# EAGLE board CM4 (EAGLE 9.6.2)
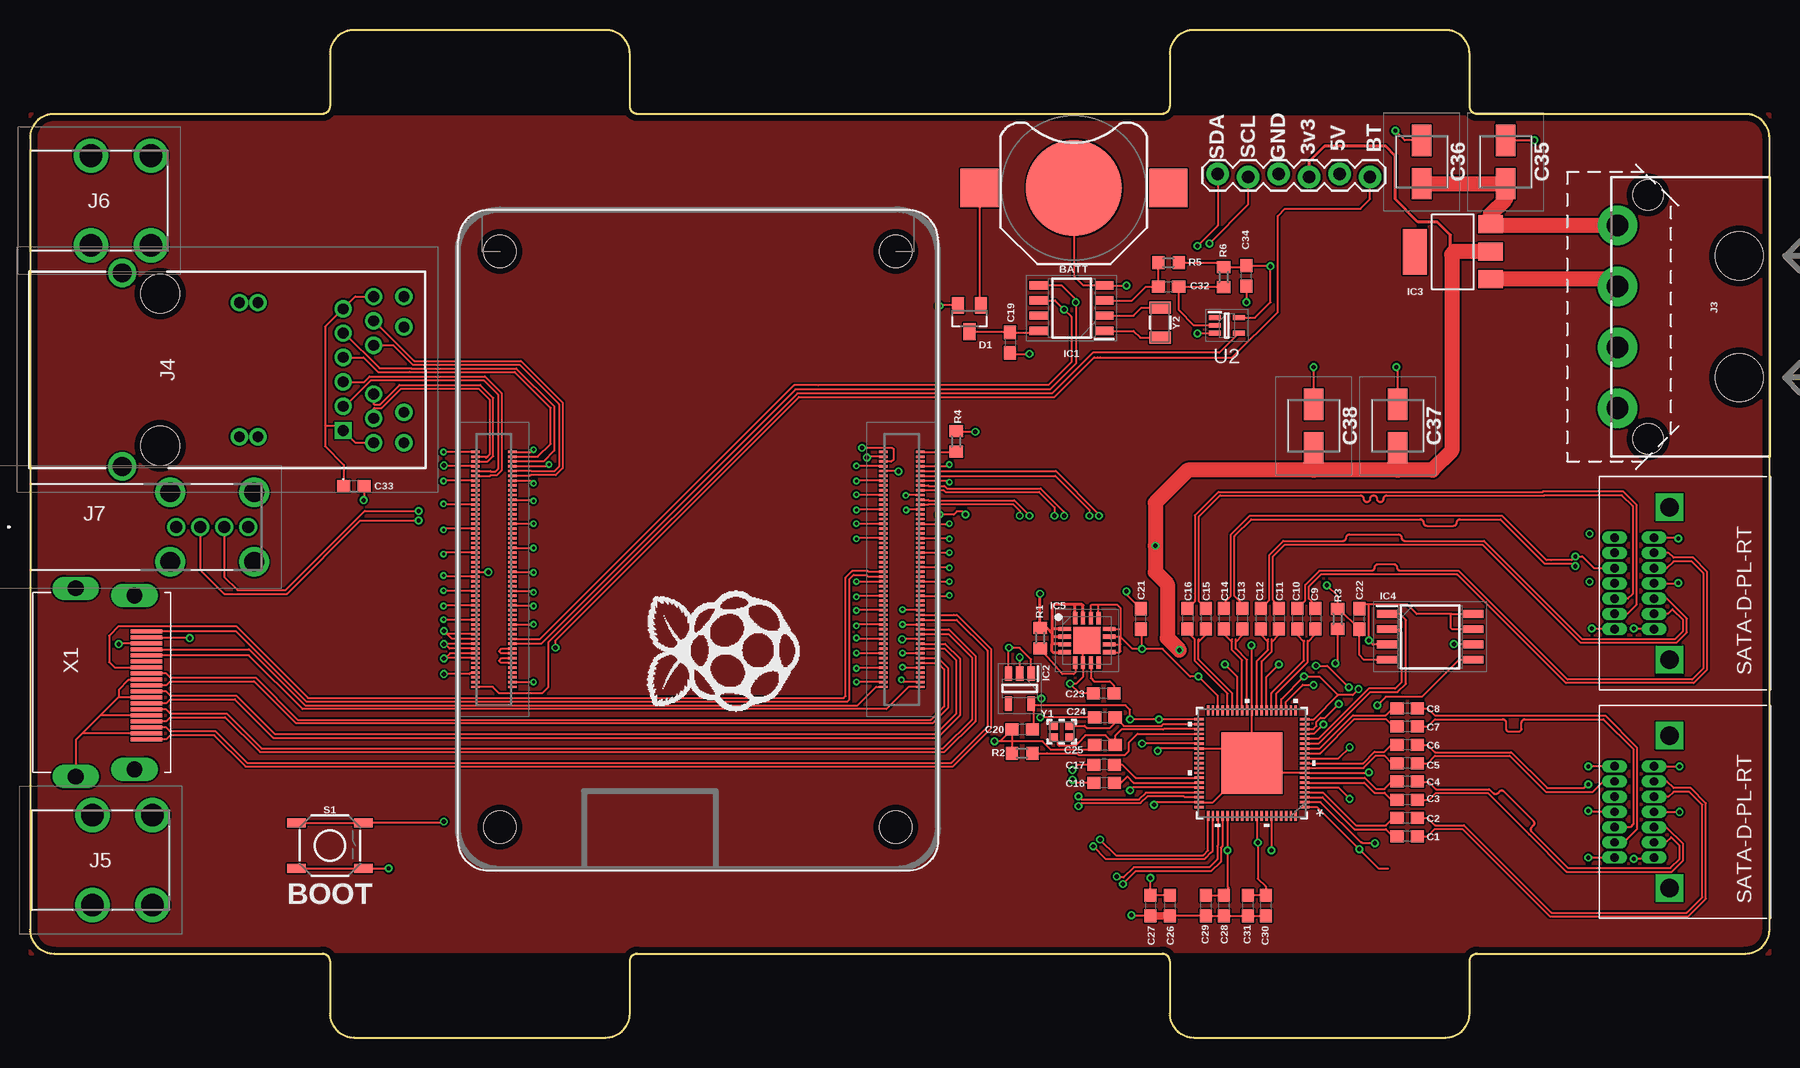
[diagram p2: board, top side]
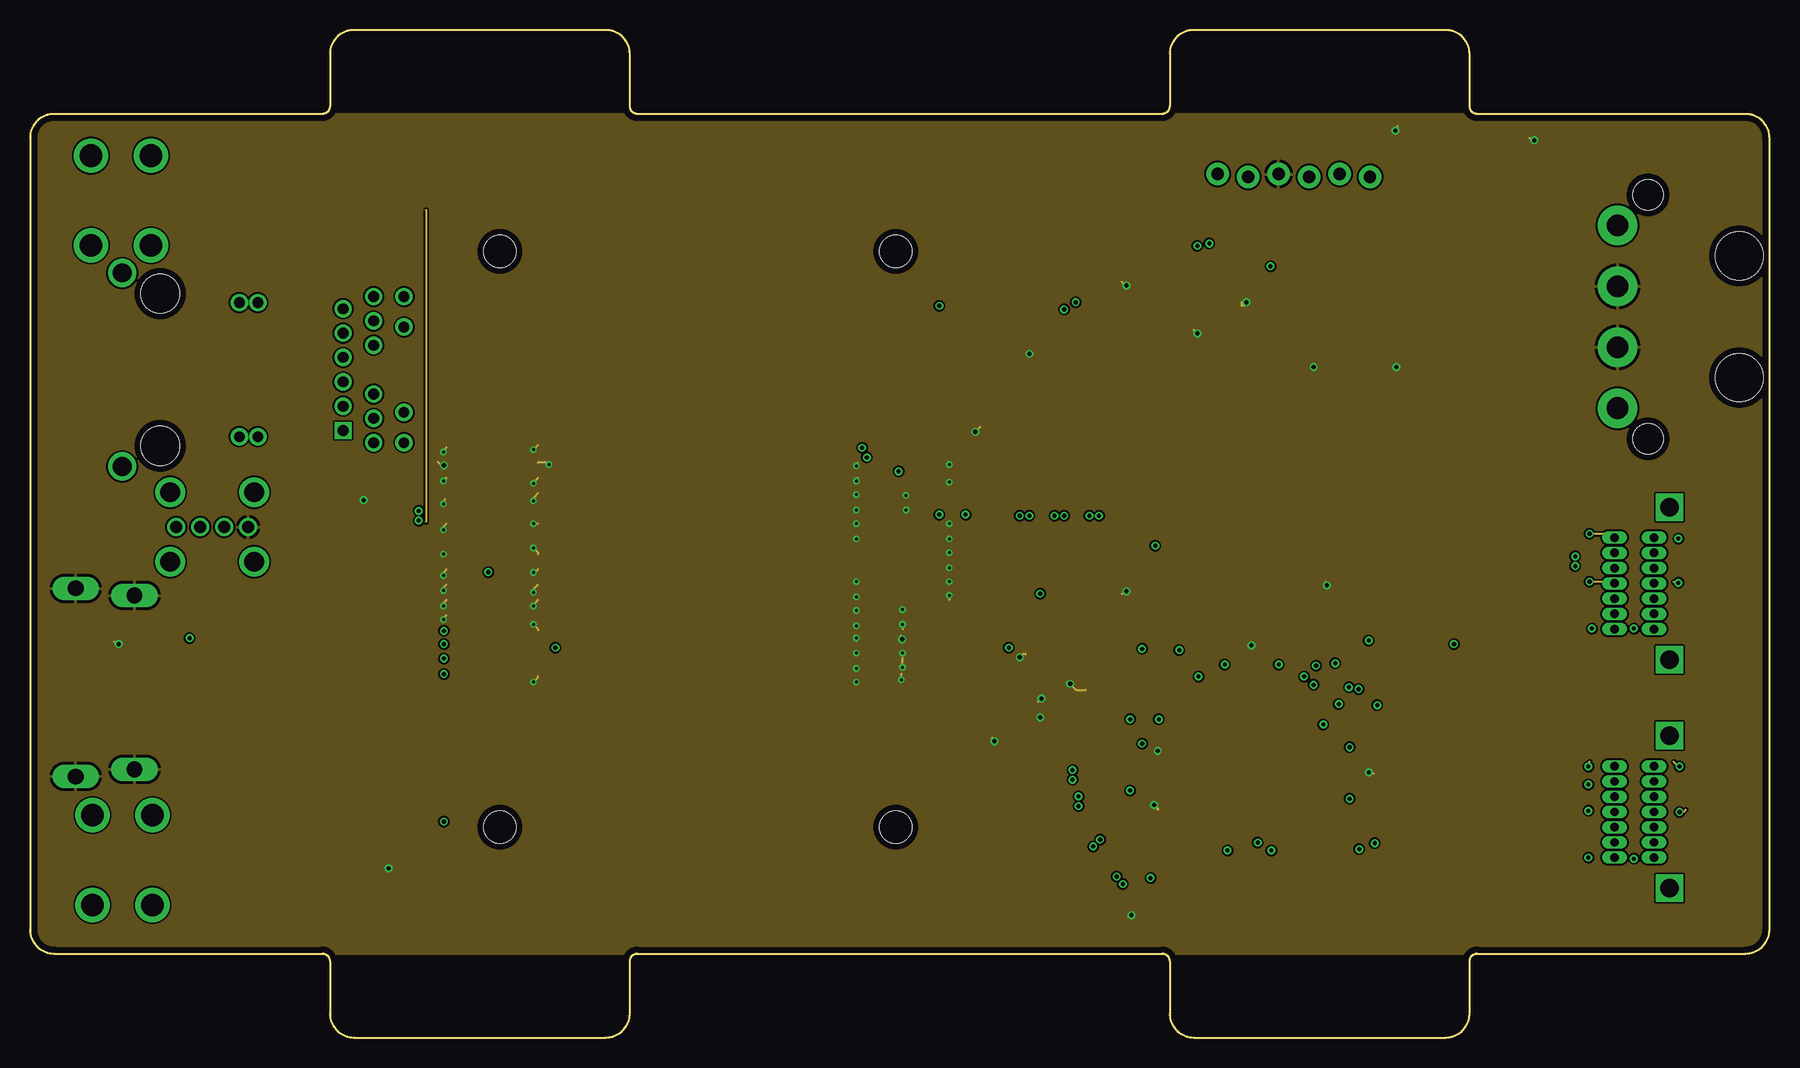
[diagram p3: board, inner layer Route2]
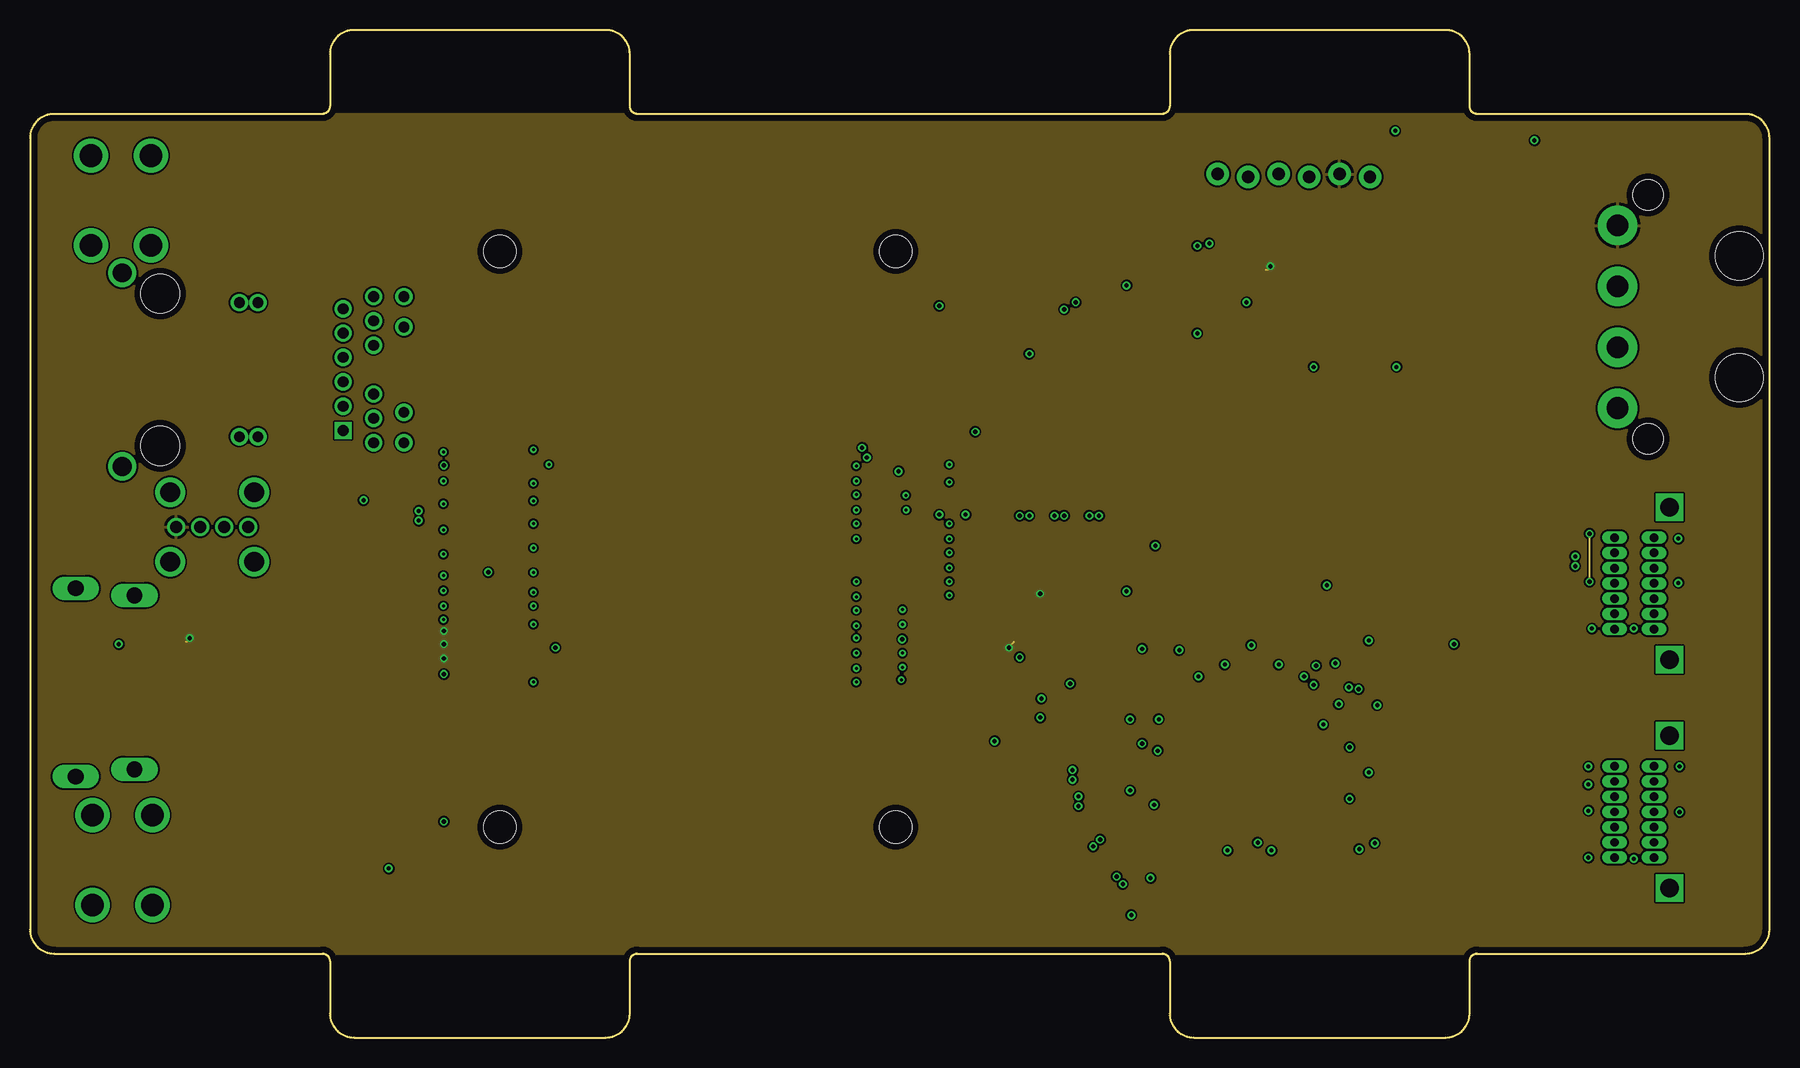
[diagram p4: board, inner layer Route15]
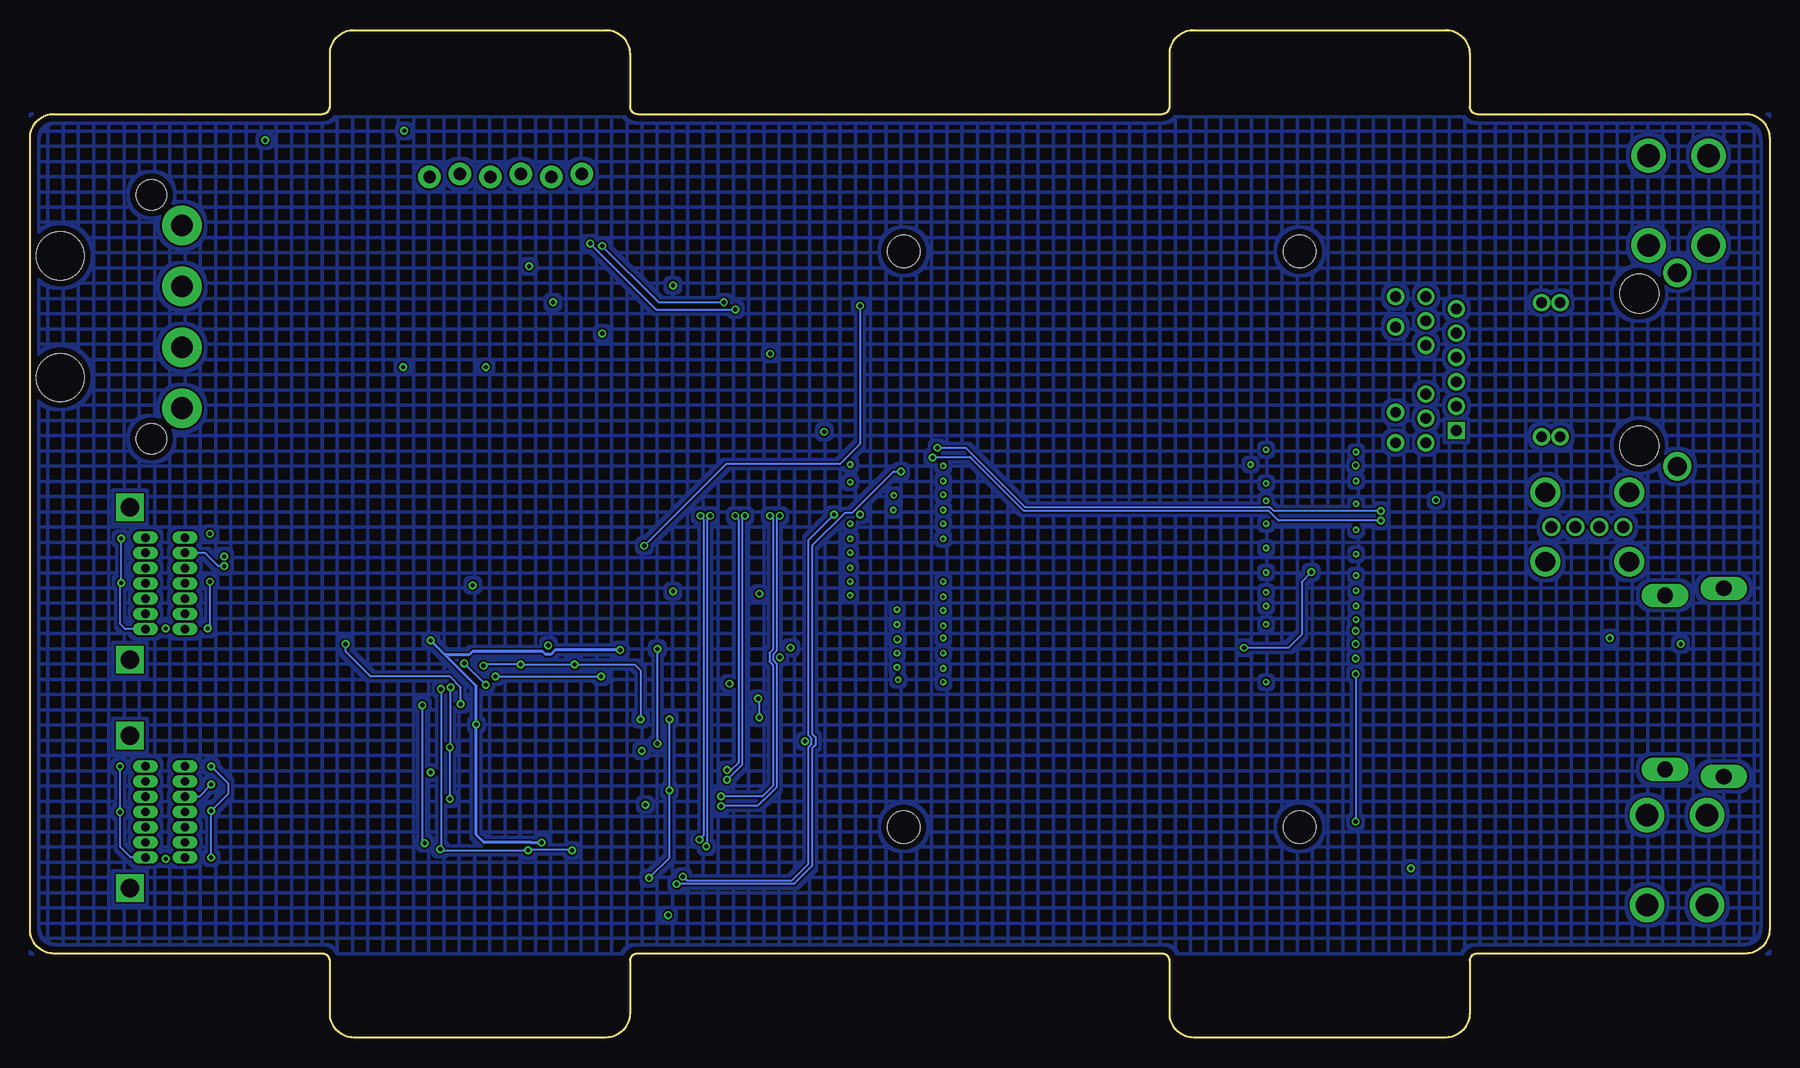
[diagram p5: board, bottom side, seen from below]

Size 145 x 84 mm. Coordinates in mm from the lower left corner, seen from the top.
Outline: 0,73.89 0,9.57
Outline: 2,7 24.36,7 arc-90 25,6.37 25,2 arc90 27,0 48,0 arc90 50,2 50,6.37 arc-90 50.63,7 94.36,7 arc-90 95,6.37 95,2 arc90 97,0 118,0 arc90 120,2 120,6.37 arc-90 120.64,7 143,7 arc90 145,9 145,75 arc90 143,77 120.64,77 arc-90 120,77.64 120,82 arc90 118,84 97,84 arc90 95,82 95,77.64 arc-90 94.36,77 50.63,77 arc-90 50,77.64 50,82 arc90 48,84 27,84 arc90 25,82 25,77.64 arc-90 24.36,77 2,77 arc90 0,75 0,9 arc90 2,7
Copper layers (1+2*15+16): Top 0.035mm / dielectric 1.5mm / Route2 0.035mm / dielectric 0.15mm / Route15 0.035mm / dielectric 0.2mm / Bottom 0.035mm
Design rules "default *": minimum track width 6mil, minimum drill 0.35mm, track to track 6mil, track to pad 6mil, pad to pad 6mil, via to via 6mil, smd to smd 6mil, copper to edge 20mil, drill to drill 6mil, minimum pad ring 6mil, minimum via ring 6mil, stop-mask expansion 4mil, vias tented up to drill 20mil, thermal gap 10mil
tKeepout: area 91.9,12.9 to 111.8,32.8
bKeepout: area 25,0 to 120,7
tRestrict: area 25,77 to 120,84; area 25,0 to 120,7
bRestrict: area 25,77 to 120,84

## Footprints (pad centres in the part's own frame; a part is rotated, then mirrored left to right if it is on the bottom)
BATTCON_12MM = smd 8 x 8: GND 0,0 | smd 3.175 x 3.175: PWR@1 -7.874,0; PWR@2 7.874,0
0603 = smd 1.1 x 1: 1 -0.85,0; 2 0.85,0
865080640004 = smd 2.6 x 1.6: 1 1.8,0; 2 -1.8,0
SOT23 = smd 1 x 1.4: 1 -0.95,-1.1; 2 0.95,-1.1; 3 0,1.1
SOIC127P600X175-8N = smd 1.55 x 0.7: 1 -2.725,1.905; 2 -2.725,0.635; 3 -2.725,-0.635; 4 -2.725,-1.905; 5 2.725,-1.905; 6 2.725,-0.635; 7 2.725,0.635; 8 2.725,1.905
SOT95P280X145-5N = smd 1.2 x 0.6: 1 -1.25,0.95; 2 -1.25,0; 3 -1.25,-0.95; 4 1.25,-0.95; 5 1.25,0.95
SOT223 = smd 1.499 x 2.007: 1 -2.261,-3.15; 2 0.025,-3.15; 3 2.311,-3.15 | smd 3.81 x 2.007: 4 0,3.15
SOIC127P790X216-8N = smd 1.65 x 0.65: 1 -3.6,1.905; 2 -3.6,0.635; 3 -3.6,-0.635; 4 -3.6,-1.905; 5 3.6,-1.905; 6 3.6,-0.635; 7 3.6,0.635; 8 3.6,1.905
QFN65P400X400X80-17N = smd 1.05 x 0.35: 1 -1.85,0.975; 2 -1.85,0.325; 3 -1.85,-0.325; 4 -1.85,-0.975; 9 1.85,-0.975; 10 1.85,-0.325; 11 1.85,0.325; 12 1.85,0.975 | smd 0.35 x 1.05: 5 -0.975,-1.85; 6 -0.325,-1.85; 7 0.325,-1.85; 8 0.975,-1.85; 13 0.975,1.85; 14 0.325,1.85; 15 -0.325,1.85; 16 -0.975,1.85 | smd 2.25 x 2.25: 17 0,0
1X06_LOCK = drill 1.016 pad 1.88: 1 0,0; 2 2.54,-0.254; 3 5.08,0; 4 7.62,-0.254; 5 10.16,0; 6 12.7,-0.254
COMPUTER-PERIPHERAL-POWER-RA-VT = drill 1.82 pad 3.302: 5V -7.62,-2.54; 12V 7.62,-2.54; GND@1 -2.54,-2.54; GND@2 2.54,-2.54 | hole 2.54: -10.16,0; 10.16,0 | hole 3.988: -5.08,7.62; 5.08,7.62
22505081 = drill 0.89 pad 1.446 square: 1 0,0 | drill 0.89 pad 1.446: 2 -2.032,0; 3 -4.064,0; 4 -6.096,0; 5 -8.128,0; 6 -10.16,0; 7 1.016,2.54; 8 -1.016,2.54; 9 -3.048,2.54; 10 -7.112,2.54; 11 -9.144,2.54; 12 -11.176,2.54; 13 0.51,-7.11; 14 -10.67,-7.11; 15 0.51,-8.65; 16 -10.67,-8.65; 17 1.016,5.08; 18 -1.524,5.08; 19 -8.636,5.08; 20 -11.176,5.08 | drill 1.57 pad 2.355: MH1 -13.145,-18.42; MH2 2.985,-18.42 | hole 3.25: -11.43,-15.24; 1.27,-15.24
81903 = drill 1.9 pad 2.85: 1 0,0; 2 0,7.49; 3 5,0; 4 5,7.49
KUSBXHTSLAS1NOHRF = drill 0.97 pad 1.509: 1 0,0; 2 2,0; 3 4,0; 4 6,0 | drill 1.65 pad 2.475: MH1 -0.5,-2.9; MH2 -0.5,2.9; MH3 6.5,-2.9; MH4 6.5,2.9
R0603 = smd 1 x 1.1: 1 -0.85,0; 2 0.85,0
TACTILE_SWITCH_SMD_5.2MM = smd 1.524 x 0.762: 1 -2.794,1.905; 2 2.794,1.905; 3 -2.794,-1.905; 4 2.794,-1.905
QFN76_9X9_MTG = smd 0.813 x 0.203: 1 -4.394,3.658; 2 -4.394,3.251; 3 -4.394,2.845; 4 -4.394,2.438; 5 -4.394,2.032; 6 -4.394,1.626; 7 -4.394,1.219; 8 -4.394,0.813; 9 -4.394,0.406; 10 -4.394,0; 11 -4.394,-0.406; 12 -4.394,-0.813; 13 -4.394,-1.219; 14 -4.394,-1.626; 15 -4.394,-2.032; 16 -4.394,-2.438; 17 -4.394,-2.845; 18 -4.394,-3.251; 19 -4.394,-3.658; 39 4.394,-3.658; 40 4.394,-3.251; 41 4.394,-2.845; 42 4.394,-2.438; 43 4.394,-2.032; 44 4.394,-1.626; 45 4.394,-1.219; 46 4.394,-0.813; 47 4.394,-0.406; 48 4.394,0; 49 4.394,0.406; 50 4.394,0.813; 51 4.394,1.219; 52 4.394,1.626; 53 4.394,2.032; 54 4.394,2.438; 55 4.394,2.845; 56 4.394,3.251; 57 4.394,3.658 | smd 0.203 x 0.813: 20 -3.658,-4.394; 21 -3.251,-4.394; 22 -2.845,-4.394; 23 -2.438,-4.394; 24 -2.032,-4.394; 25 -1.626,-4.394; 26 -1.219,-4.394; 27 -0.813,-4.394; 28 -0.406,-4.394; 29 0,-4.394; 30 0.406,-4.394; 31 0.813,-4.394; 32 1.219,-4.394; 33 1.626,-4.394; 34 2.032,-4.394; 35 2.438,-4.394; 36 2.845,-4.394; 37 3.251,-4.394; 38 3.658,-4.394; 58 3.658,4.394; 59 3.251,4.394; 60 2.845,4.394; 61 2.438,4.394; 62 2.032,4.394; 63 1.626,4.394; 64 1.219,4.394; 65 0.813,4.394; 66 0.406,4.394; 67 0,4.394; 68 -0.406,4.394; 69 -0.813,4.394; 70 -1.219,4.394; 71 -1.626,4.394; 72 -2.032,4.394; 73 -2.438,4.394; 74 -2.845,4.394; 75 -3.251,4.394; 76 -3.658,4.394 | smd 5.105 x 5.105: 77 0,0
SOT65P210X110-5N = smd 1 x 0.4: 1 -1,0.65; 2 -1,0; 3 -1,-0.65; 4 1,-0.65; 5 1,0.65
RASPBERRYPI-CM4 = smd 0.2 x 0.7: 1 9.8,35.54; 2 9.8,32.46; 3 9.4,35.54; 4 9.4,32.46; 5 9,35.54; 6 9,32.46; 7 8.6,35.54; 8 8.6,32.46; 9 8.2,35.54; 10 8.2,32.46; 11 7.8,35.54; 12 7.8,32.46; 13 7.4,35.54; 14 7.4,32.46; 15 7,35.54; 16 7,32.46; 17 6.6,35.54; 18 6.6,32.46; 19 6.2,35.54; 20 6.2,32.46; 21 5.8,35.54; 22 5.8,32.46; 23 5.4,35.54; 24 5.4,32.46; 25 5,35.54; 26 5,32.46; 27 4.6,35.54; 28 4.6,32.46; 29 4.2,35.54; 30 4.2,32.46; 31 3.8,35.54; 32 3.8,32.46; 33 3.4,35.54; 34 3.4,32.46; 35 3,35.54; 36 3,32.46; 37 2.6,35.54; 38 2.6,32.46; 39 2.2,35.54; 40 2.2,32.46; 41 1.8,35.54; 42 1.8,32.46; 43 1.4,35.54; 44 1.4,32.46; 45 1,35.54; 46 1,32.46; 47 0.6,35.54; 48 0.6,32.46; 49 0.2,35.54; 50 0.2,32.46; 51 -0.2,35.54; 52 -0.2,32.46; 53 -0.6,35.54; 54 -0.6,32.46; 55 -1,35.54; 56 -1,32.46; 57 -1.4,35.54; 58 -1.4,32.46; 59 -1.8,35.54; 60 -1.8,32.46; 61 -2.2,35.54; 62 -2.2,32.46; 63 -2.6,35.54; 64 -2.6,32.46; 65 -3,35.54; 66 -3,32.46; 67 -3.4,35.54; 68 -3.4,32.46; 69 -3.8,35.54; 70 -3.8,32.46; 71 -4.2,35.54; 72 -4.2,32.46; 73 -4.6,35.54; 74 -4.6,32.46; 75 -5,35.54; 76 -5,32.46; 77 -5.4,35.54; 78 -5.4,32.46; 79 -5.8,35.54; 80 -5.8,32.46; 81 -6.2,35.54; 82 -6.2,32.46; 83 -6.6,35.54; 84 -6.6,32.46; 85 -7,35.54; 86 -7,32.46; 87 -7.4,35.54; 88 -7.4,32.46; 89 -7.8,35.54; 90 -7.8,32.46; 91 -8.2,35.54; 92 -8.2,32.46; 93 -8.6,35.54; 94 -8.6,32.46; 95 -9,35.54; 96 -9,32.46; 97 -9.4,35.54; 98 -9.4,32.46; 99 -9.8,35.54; 100 -9.8,32.46; 101 9.8,1.54; 102 9.8,-1.54; 103 9.4,1.54; 104 9.4,-1.54; 105 9,1.54; 106 9,-1.54; 107 8.6,1.54; 108 8.6,-1.54; 109 8.2,1.54; 110 8.2,-1.54; 111 7.8,1.54; 112 7.8,-1.54; 113 7.4,1.54; 114 7.4,-1.54; 115 7,1.54; 116 7,-1.54; 117 6.6,1.54; 118 6.6,-1.54; 119 6.2,1.54; 120 6.2,-1.54; 121 5.8,1.54; 122 5.8,-1.54; 123 5.4,1.54; 124 5.4,-1.54; 125 5,1.54; 126 5,-1.54; 127 4.6,1.54; 128 4.6,-1.54; 129 4.2,1.54; 130 4.2,-1.54; 131 3.8,1.54; 132 3.8,-1.54; 133 3.4,1.54; 134 3.4,-1.54; 135 3,1.54; 136 3,-1.54; 137 2.6,1.54; 138 2.6,-1.54; 139 2.2,1.54; 140 2.2,-1.54; 141 1.8,1.54; 142 1.8,-1.54; 143 1.4,1.54; 144 1.4,-1.54; 145 1,1.54; 146 1,-1.54; 147 0.6,1.54; 148 0.6,-1.54; 149 0.2,1.54; 150 0.2,-1.54; 151 -0.2,1.54; 152 -0.2,-1.54; 153 -0.6,1.54; 154 -0.6,-1.54; 155 -1,1.54; 156 -1,-1.54; 157 -1.4,1.54; 158 -1.4,-1.54; 159 -1.8,1.54; 160 -1.8,-1.54; 161 -2.2,1.54; 162 -2.2,-1.54; 163 -2.6,1.54; 164 -2.6,-1.54; 165 -3,1.54; 166 -3,-1.54; 167 -3.4,1.54; 168 -3.4,-1.54; 169 -3.8,1.54; 170 -3.8,-1.54; 171 -4.2,1.54; 172 -4.2,-1.54; 173 -4.6,1.54; 174 -4.6,-1.54; 175 -5,1.54; 176 -5,-1.54; 177 -5.4,1.54; 178 -5.4,-1.54; 179 -5.8,1.54; 180 -5.8,-1.54; 181 -6.2,1.54; 182 -6.2,-1.54; 183 -6.6,1.54; 184 -6.6,-1.54; 185 -7,1.54; 186 -7,-1.54; 187 -7.4,1.54; 188 -7.4,-1.54; 189 -7.8,1.54; 190 -7.8,-1.54; 191 -8.2,1.54; 192 -8.2,-1.54; 193 -8.6,1.54; 194 -8.6,-1.54; 195 -9,1.54; 196 -9,-1.54; 197 -9.4,1.54; 198 -9.4,-1.54; 199 -9.8,1.54; 200 -9.8,-1.54 | hole 2.7: -21.5,33.5; 26.5,33.5; -21.5,0.5; 26.5,0.5
RIGHTANGLE2PORTSATA = drill 0.7 pad 0.813 long: 1_1 -3.81,0; 1_2 -2.54,0; 1_3 -1.27,0; 1_4 0,0; 1_5 1.27,0; 1_6 2.54,0; 1_7 3.81,0; 2_1 -3.81,-3.302; 2_2 -2.54,-3.302; 2_3 -1.27,-3.302; 2_4 0,-3.302; 2_5 1.27,-3.302; 2_6 2.54,-3.302; 2_7 3.81,-3.302 | drill 1.524 pad 2.184 square: P$8 -6.35,-4.597; P$9 6.35,-4.597
HDMI = smd 0.3 x 2.6: 1 4.75,4; 2 4.25,4; 3 3.75,4; 4 3.25,4; 5 2.75,4; 6 2.25,4; 7 1.75,4; 8 1.25,4; 9 0.75,4; 10 0.25,4; 11 -0.25,4; 12 -0.75,4; 13 -1.25,4; 14 -1.75,4; 15 -2.25,4; 16 -2.75,4; 17 -3.25,4; 18 -3.75,4; 19 -4.25,4 | drill 1.3 long: P$1 7.25,3; P$2 -7.25,3; P$3 -7.85,-1.9; P$4 7.85,-1.9
CRYSTAL-SMD-2.0X1.6MM = smd 0.75 x 0.7: 1 -0.675,-0.5; 2 0.675,-0.5; 3 0.675,0.5; 4 -0.675,0.5
CRYSTAL-SMD-3.2X1.5MM = smd 1 x 1.8: P$1 -1.25,0; P$2 1.25,0

## Placement (x,y rotation side)
BATT  [BATTCON_12MM]  87.01,70.83 0 top
C1  0.1uF  [0603]  114.81,16.78 180 top
C2  0.1uF  [0603]  114.81,18.3 180 top
C3  0.1uF  [0603]  114.81,19.83 180 top
C4  0.1uF  [0603]  114.81,21.35 180 top
C5  0.1uF  [0603]  114.81,22.88 180 top
C6  0.1uF  [0603]  114.81,24.4 180 top
C7  0.1uF  [0603]  114.81,25.92 180 top
C8  0.1uF  [0603]  114.81,27.45 180 top
C9  0.1uF  [0603]  107.16,34.92 270 top
C10  0.1uF  [0603]  105.64,34.92 270 top
C11  0.1uF  [0603]  104.11,34.92 270 top
C12  0.1uF  [0603]  102.59,34.92 270 top
C13  0.1uF  [0603]  101.06,34.92 270 top
C14  0.1uF  [0603]  99.54,34.92 270 top
C15  0.1uF  [0603]  98.02,34.92 270 top
C16  0.1uF  [0603]  96.49,34.92 270 top
C17  0.1uF  [0603]  89.53,22.75 180 top
C18  0.1uF  [0603]  89.53,21.22 180 top
C19  0.1uF  [0603]  81.7,57.94 270 top
C20  1uF  [0603]  82.7,25.7 0 top
C21  4.7uF  [0603]  92.6,34.9 90 top
C22  0.1uF  [0603]  110.8,34.9 90 top
C23  10nF  [0603]  89.5,28.7 180 top
C24  18pF  [0603]  89.6,26.7 0 top
C25  18pF  [0603]  89.6,24.4 0 top
C26  1uF  [0603]  95,11 270 top
C27  2.2uF  [0603]  93.4,11 270 top
C28  1uF  [0603]  99.5,11 270 top
C29  2.2uF  [0603]  98,11 270 top
C30  1uF  [0603]  103,11 270 top
C31  2.2uF  [0603]  101.5,11 270 top
C32  0.1uF  [0603]  94.9,62.6 0 top
C33  0.1uF  [0603]  27,46 0 top
C34  0.1uF  [0603]  101.4,63.5 90 top
C35  865080640004  [865080640004]  123,73 270 top
C36  865080640004  [865080640004]  116,73 270 top
C37  865080640004  [865080640004]  114,51 270 top
C38  865080640004  [865080640004]  107,51 270 top
D1  BAT54C  [SOT23]  78.31,59.94 180 top
IC1  PCF85063AT_AAZ  [SOIC127P600X175-8N]  86.83,60.82 180 top
IC2  MIC5504-1.8YM5-TR  [SOT95P280X145-5N]  82.5,29.1 270 top
IC3  REG1117  [SOT223]  118.6,65.5 90 top
IC4  W25X40CLSSIG  [SOIC127P790X216-8N]  116.7,33.4 0 top
IC5  ADP1740ACPZ-1.0-R7  [QFN65P400X400X80-17N]  88.1,33.1 0 top
J1  [1X06_LOCK]  99,72 0 top
J3  COMPUTER_PERIPHERAL_POWERRA-VT  [COMPUTER-PERIPHERAL-POWER-RA-VT]  134.87,60.09 270 top
J4  2250508-1  [22505081]  26.1,50.6 270 top
J5  8190-3  [81903]  5.21,11.05 0 top
J6  8190-3  [81903]  5.08,66.04 0 top
J7  KUSBXHT-SLAS1N-O-HRF  [KUSBXHTSLAS1NOHRF]  12.19,42.56 0 top
R1  100k  [R0603]  84.2,33.3 90 top
R2  6.04k  [R0603]  82.7,23.7 0 top
R3  10K  [R0603]  109,34.9 270 top
R4  10K  [R0603]  77.2,49.7 270 top
R5  510k  [R0603]  94.9,64.6 0 top
R6  510K  [R0603]  99.5,63.4 90 top
S1  MOMENTARY-SWITCH-SPST-SMD-5.2-REDUNDANT  [TACTILE_SWITCH_SMD_5.2MM]  25,16 0 top
U1  88SE9215A1-NAA2C000  [QFN76_9X9_MTG]  101.85,22.88 180 top
U2  74LVC1G07SE-7  [SOT65P210X110-5N]  99.76,59.37 0 top
U$1  Raspberry Pi Compute Module  [RASPBERRYPI-CM4]  72.67,39.03 90 top
U$2  SATA-D-PL-RT  [RIGHTANGLE2PORTSATA]  132.08,37.86 90 top
U$3  SATA-D-PL-RT  [RIGHTANGLE2PORTSATA]  132.08,18.81 90 top
X1  HDMI  [HDMI]  5.71,29.61 270 top
Y1  25MHz  [CRYSTAL-SMD-2.0X1.6MM]  86,25.5 180 top
Y2  32.768kHz  [CRYSTAL-SMD-3.2X1.5MM]  94.2,59.6 270 top

## Tracks (layer width: path | path; a pad name or v marks a point on that pad's centre or on a via)
1.0VDC  (via drill 0.35)
  Top 0.152: U1.44 v92.7,24.5 | v92.7,32.4 91.9,32.4 90.9,33.4 | 90.85,33.4 90.9,33.4 | U1.36 99.01,28.49 v97.4,30.1 96.7,30.1 94.4,32.4 v92.7,32.4 | U1.23 104.29,28.19 v106.2,30.1 107.48,30.1 109.03,28.55 | U1.1 107.28,19.22 v110.8,15.7 112.4,14.1 113.2,14.1 | U1.62 v99.82,15.6 99.82,12.58 99.9,12.5 99.9,12.25 C28.1 C29.1 | U1.71 v103.48,15.6 | 109.03,28.55 107.02,26.53 U1.19 | v110.75,29.05 110.25,28.55 109.03,28.55 | IC5.14 88.42,36.02 88.5,36.1 89.1,36.1 | 89.1,36.1 90.6,36.1 90.9,35.8 90.9,34.1 | 90.9,34.1 90.9,33.4 | IC5.10 90.9,32.77 | IC5.11 90.88,33.42 90.9,33.4 | IC5.12 90.88,34.08 90.9,34.1 | IC5.13 89.08,36.08 89.1,36.1 | IC5.9 90.83,32.12 90.9,32.2 90.9,32.77 | 90.9,32.77 90.9,33.4 | v92.7,32.4 92.7,33.95 C21.1
  Bottom 0.152: v92.7,24.5 v92.7,32.4 | v106.2,30.1 v97.4,30.1 | v110.75,29.05 110.75,15.75 v110.8,15.7 110.7,15.6 v103.48,15.6 103.39,15.69 99.92,15.69 v99.82,15.6
1.8V-OUT
  Top 0.152: U$1.90 39.27,31.23 39.1,31.4 39.33,31.63 U$1.88
1.8VDC  (via drill 0.35)
  Top 0.152: U1.39 97.4,26.53 | 97.4,26.53 v94.1,26.53 92,26.53 | 92,26.53 v91.7,26.53 91.7,27.33 91.33,27.7 83.6,27.7 IC2.5 83.65,27.65 83.65,25.8 C20.2 83.73,25.52 | U1.53 91.94,20.84 v91.7,20.6 | 97.43,26.5 97.4,26.53 | U1.26 103.07,30.07 v104.1,31.1 | U1.32 100.64,30.07 v99.6,31.1 | U1.5 109.06,20.84 v110,19.9 | U1.11 109.08,23.28 v110,24.2 | v107.2,31 108.14,31 v109.94,29.2 | 91.78,26.75 92,26.53 | C26.1 C27.1 v93.4,13.3
  Bottom 0.152: v91.7,26.53 v91.7,20.6 91.7,15 v93.4,13.3 | v110,19.9 v110,24.2 110,29.14 | 110,29.2 110,29.14 | v94.1,26.53 94.1,30.6 94.6,31.1 v99.6,31.1 v104.1,31.1 107.1,31.1 v107.2,31 | v109.94,29.2 110,29.14
3.3V-OUT
  Top 0.152: U$1.86 39.27,32.03 39.1,32.2 39.33,32.43 U$1.84
3V3  (via drill 0.35)
  Top 0.152: IC4.7 118.56,34.03 118.4,34.2 118.4,35.2 118.5,35.3 | 118.5,35.3 IC4.8 | 118.5,35.3 115.59,35.3 114.8,36.1 111.6,36.1 | 111.6,36.1 111.15,36.1 C22.2 | IC4.3 111.94,32.77 v111.6,33.1 111.6,36.1 | U1.68 102.26,16.24 102.3,16.2 v102.35,16.25 102.35,13.25 103,12.6 C30.1 C31.1 | v107.8,26.1 107.01,25.31 U1.16 | D1.2 75.84,61.04 v75.8,61 | C38.1 107,47.3 | C37.1 114,47.3
  Top 0.254: 94,38.6 94.8,37.8 | 118.72,65.53 118.4,65.85 118.4,66.9 117.3,68 115.7,68 113.8,69.9 113.8,73.5 113,74.3 107.9,74.3 106.62,73.02 J1.4
  Top 1.27: v95.8,32.3 94.8,33.3 94.8,37.8 93.8,38.8 v93.8,41 93.8,44.6 96.5,47.3 107,47.3 114,47.3 116.9,47.3 118.5,48.9 118.5,65.3 118.72,65.53 IC3.2
  Bottom 0.152: 103.24,16.25 103.25,16.26 | v75.8,61 75.8,49.5 77.5,47.8 87,47.8 v93.8,41
  Bottom 0.254: v102.35,16.25 103.24,16.25 | 103.25,16.26 107.16,16.26 107.8,16.9 v107.8,26.1 107.8,29.3 110.4,31.9 | v95.8,32.3 101.21,32.3 101.57,31.94 102.03,31.94 102.29,32.2 108.1,32.2 108.4,31.9 110.4,31.9 | 110.4,31.9 v111.6,33.1
5VDC  (via drill 0.35)
  Top 0.152: 87.78,36.02 87.7,36.1 | 86.22,32.1 IC5.4 | IC5.3 86.22,32.8 | IC5.2 86.22,33.4 | 85.22,34.08 85.2,34.1 | IC5.16 87.1,34.98 | R1.2 84.75,34.15 | U$1.87 34.6,31.63 | 34.6,31.63 34.5,31.63 v34.5,31.6 | U$1.85 35,32.03 34.6,31.63 | U$1.81 37.1,32.8 34.6,32.8 | 34.6,32.8 v34.5,32.8 | U$1.83 34.97,32.43 34.6,32.8 | U$1.77 34.77,33.63 | 34.77,33.63 v34.5,33.9 | U$1.79 35.17,33.23 34.77,33.63 | IC2.3 81.55,32.45 v81.6,32.5 82.49,32.5 83.45,31.54 IC2.1 | X1.18 13.24,33.36 v13.3,33.3 | R5.2 99.15,64.6 R6.2 101.3,64.25 C34.2 103.35,64.35 v103.4,64.3 103.4,61.3 102.12,60.02 U2.5
  Top 0.254: IC5.15 87.78,36.02 | 87.7,36.1 87.1,36.1 | 87.1,36.1 85.3,36.1 85.2,36 85.2,34.1 85.2,33.7 | 85.2,33.7 85.2,33.4 | 85.2,33.4 85.2,32.8 | 85.2,32.8 85.2,32.2 85.3,32.1 86.22,32.1 | 86.22,32.8 85.2,32.8 | 86.22,33.4 85.2,33.4 | IC5.1 85.22,34.08 | 87.1,34.98 87.1,36.1 | 84.75,34.15 85.2,33.7 | R1.2 v84.2,37
  Top 1.27: J3.5V 121.86,67.71 IC3.3 121.75,68.65 123,69.9 C35.1 C36.1
  Route15 0.152: v81.6,32.5 81.6,32.6 82,33 | v13.3,33.3 13,33 | v103.4,64.3 103.1,64 103,64
  pour Route15: 0,77 145,77 145,7 0,7
BUTTON  (via drill 0.35)
  Top 0.152: U$1.51 38.17,38.83 v38.2,38.8 | v43.8,32.5 43.8,33.1 64.1,53.4 85.4,53.4 88.7,56.7 89,56.7 89.2,56.7 100.2,56.7 104,60.5 104,68.5 104.6,69.1 110.9,69.1 111.7,69.9 J1.6
  Bottom 0.152: v38.2,38.8 39,38 39,33.6 40.1,32.5 v43.8,32.5
GLOBAL_EN
  Top 0.152: U2.4 99.14,57.1 88.6,57.1 85.2,53.7 63.97,53.7 43.2,32.93 43.2,29.2 42.7,28.7 39.1,28.7 38.57,29.23 U$1.99
GND  (via drill 0.25, 0.35)
  Top 0.152: U$1.8 43.12,47.63 v43.26,47.77 | U$1.2 41.78,48.83 v41.96,49.01 | U$1.14 41.73,46.43 v41.96,46.2 | U$1.22 41.87,44.83 v41.96,44.74 | U$1.32 v41.96,42.84 | U$1.42 41.94,40.83 v41.96,40.81 | U$1.52 41.91,38.83 v41.96,38.78 | U$1.60 41.85,37.23 v41.96,37.12 | U$1.66 41.91,36.03 v41.96,35.98 | U$1.74 41.93,34.43 v41.96,34.46 | U$1.98 v41.96,29.63 | U$1.107 68.92,47.63 v68.88,47.67 | U$1.113 68.92,46.43 v68.88,46.4 | U$1.119 68.91,45.23 v68.88,45.25 | U$1.125 68.93,44.03 v68.88,43.98 | U$1.131 68.89,42.83 v68.88,42.84 | U$1.137 68.94,41.63 v68.88,41.57 | U$1.161 68.97,36.83 v68.88,36.74 | U$1.167 68.91,35.63 v68.88,35.6 | U$1.173 68.98,34.43 v68.88,34.33 | U$1.179 68.97,33.23 v68.88,33.31 | U$1.185 68.9,32.03 v68.88,32.05 | U$1.191 68.94,30.83 v68.88,30.77 | U$1.197 v68.89,29.63 v68.88,29.63 | U$1.108 76.49,47.63 v76.63,47.77 | U$1.114 76.5,46.43 v76.63,46.3 | U$1.126 73.08,44.03 v73.03,43.98 | U$1.132 v76.62,42.83 v76.63,42.84 | U$1.138 76.57,41.63 v76.63,41.57 | U$1.144 v76.63,40.43 | U$1.150 76.56,39.23 v76.63,39.16 | U$1.155 68.9,38.03 v68.88,38.01 | U$1.156 76.61,38.03 v76.63,38.01 | U$1.162 76.59,36.83 v76.63,36.87 | v72.73,35.67 72.77,35.63 U$1.168 | U$1.174 v72.73,34.43 | U$1.186 72.75,32.03 v72.73,32.05 | v72.73,30.88 72.78,30.83 U$1.192 | U$1.198 72.83,29.63 v72.63,29.83 | U$1.71 v34.48,34.83 v34.47,34.84 | U$1.65 34.51,36.03 v34.47,35.98 | U$1.59 34.49,37.23 v34.47,37.25 | U$1.53 34.56,38.43 v34.47,38.52 | U$1.43 34.6,40.43 v34.47,40.3 | U$1.33 34.56,42.43 v34.47,42.33 | U$1.23 34.53,44.43 v34.47,44.49 | U$1.13 34.5,46.43 v34.47,46.4 | U$1.1 34.49,48.83 v34.47,48.81 | U$1.180 72.73,33.23 v72.7,33.2 | 101.97,22.76 102.67,22.06 U1.8 111.56,22.06 v111.6,22.1
  Top 0.152: 101.97,22.76 U1.77 101.85,22.9 | 101.85,22.9 U1.29 101.85,32.7 v101.8,32.7 | 101.85,22.9 101.7,22.9 100.51,24.09 U1.45 94.19,24.09 v94,23.9 | 101.97,22.76 101.76,22.76 98.62,19.62 U1.56 93.92,19.62 v93.7,19.4 | U$1.120 73.03,45.23 v73,45.2 | IC4.4 111.2,31.5 110.8,31.9 C22.1 109.1,35.75 R3.1 109,36.8 v108.1,37.7 | IC5.17 87.78,32.77 IC5.6 87.78,30.07 87.2,29.5 v86.7,29.5 87.5,28.7 C23.2 | C25.1 88.35,24 85.1,24 84.4,24.7 v80.4,24.7 80.85,24.7 C20.1 R2.1 | IC2.2 v82.5,31.7 | C30.2 C31.2 C28.2 C29.2 C26.2 | C27.2 91.85,10.15 v91.8,10.2 | v78.8,50.5 77.25,50.5 R4.1 | C33.2 27.85,44.85 v27.8,44.8 | S1.3 S1.4 v29.89,14.09 v29.9,14.1 | X1.2 4.36,25.36 | X1.P$4 3.81,24.82 4.36,25.36 | X1.5 5.86,26.86 | 5.86,26.86 4.36,25.36 | X1.8 7.4,28.36 | 7.4,28.36 7.36,28.36 5.86,26.86 | X1.11 9.66,29.8 8.2,29.8 7.4,29 7.4,28.36 | X1.17 7.46,32.86 v7.4,32.8 | BATT.GND 87.01,63.49 87.8,62.7 89.53,62.7 IC1.4 89.58,62.7 v91.4,62.7 | U2.3 98.74,58.7 v97.3,58.7 | C19.2 81.78,57 v83.3,57 | C34.1 v101.4,61.3 | C35.2 v125.4,74.8 | C36.2 114.6,74.8 v113.8,75.6 | U$1.7 34.57,47.63 v34.5,47.7 | C24.1 84.23,26.7 v84.21,26.68 | C38.2 v107,55.9 | C37.2 114,55.8 v113.9,55.9 | C21.2 91.4,36.95 v91.4,37.2
  Top 0.61: C27.2 C26.2
  Top 1.27: J3.GND@1 131.72,63.24 IC3.1
  Route2 0.152: v43.26,47.77 43.1,47.92 42.34,47.92 | v41.96,49.01 42.34,49.39 | v41.96,46.2 41.96,46.27 42.34,46.65 | v41.96,44.74 41.96,45 42.34,45.38 | v41.96,42.84 42.34,42.84 | v41.96,40.81 42.34,40.43 42.34,40.3 | v41.96,38.78 42.09,38.78 42.34,39.03 | v41.96,37.12 41.96,37.38 42.34,37.76 | v41.96,35.98 41.96,36.11 42.34,36.49 | v41.96,34.46 42.34,34.08 42.34,33.95 | v41.96,29.63 42.34,30.01 42.34,30.14 | v68.88,47.67 68.88,47.79 69.01,47.92 | v68.88,46.4 68.88,46.52 69.01,46.65 | v68.88,45.25 69.01,45.38 | v68.88,43.98 69.01,44.11 | v68.88,42.84 69.01,42.84 | v68.88,41.57 68.88,41.44 | v68.88,36.74 68.88,36.87 | v68.88,35.6 68.88,35.47 | v68.88,34.33 68.88,34.08 | v68.88,33.31 68.88,33.06 | v68.88,32.05 68.88,31.92 | v68.88,30.77 68.88,30.65 | v68.88,29.63 68.88,29.5 | v76.63,46.3 76.63,46.17 | v73.03,43.98 73.03,44.11 | v76.63,42.84 76.63,42.71 | v76.63,41.57 76.63,41.44 | v76.63,40.43 76.63,40.3 | v76.63,39.16 76.63,39.03 | v76.63,38.01 76.63,37.76 | v76.63,36.87 76.63,36.49 | v72.73,35.67 72.73,35.42 | v72.73,34.43 72.73,34.05 | v72.73,32.05 72.73,31.92 | v72.73,30.88 72.73,31.61 | v72.63,29.83 72.63,30.34 | v34.47,34.84 34.47,34.97 34.72,35.22 | v34.47,35.98 34.47,36.24 34.72,36.49 | v34.47,37.25 34.47,37.51 34.72,37.76 | v34.47,38.52 34.47,38.78 34.72,39.03 | v34.47,40.3 34.72,40.3 | v34.47,42.33 34.47,42.59 34.72,42.84 | v34.47,44.49 34.47,44.74 34.59,44.87 | v34.47,46.4 34.72,46.65 | v34.47,48.81 34.47,48.94 34.72,49.19 | v72.7,33.2 72.6,33.3 72.6,33.5 | v86.7,29.5 87.2,29 88,29 | v94,23.9 94,24 | v111.6,22.1 111.9,22.1 112,22 | v93.7,19.4 94,19.1 94,19 | v80.4,24.7 80.2,24.9 80.2,25 | v82.5,31.7 82.8,32 83,32 | v91.8,10.2 92,10 | v78.8,50.5 79.2,50.9
  Route2 0.152: v27.8,44.8 28,45 | v29.9,14.1 30,14 | v7.4,32.8 7.2,32.8 7,33 | v91.4,62.7 91.3,62.7 91,63 | v97.3,58.7 97,59 | v101.4,61.3 101.1,61 101,61 101,61.3 | v125.4,74.8 125.2,74.8 125,75 | v113.8,75.6 113.8,75.8 114,76 | v34.5,47.7 34.3,47.7 34,48 | v84.3,28.26 84.04,28 84,28 | v108.1,37.7 108.1,37.9 108,38 | v107,55.9 107,56 | v113.9,55.9 114,56 | v91.4,37.2 91.2,37 91,37
  Bottom 0.152: v84.21,26.68 84.21,28.16 v84.3,28.26
  pour Route2: 0,7 145,7 145,77 0,77
HDMI_CK_N
  Top 0.152: U$1.190 75.67,31.23 76.2,30.7 76.2,27.6 75.1,26.5 22.3,26.5 18.8,30 11.7,30 11.35,30.36 X1.12
HDMI_CK_P
  Top 0.152: U$1.188 75.7,31.63 76.5,30.83 76.5,27.47 75.32,26.28 | X1.10 11.36,29.36 11.7,29.7 18.67,29.7 22.08,26.28 | 75.32,26.28 | 75.32,26.28 75.23,26.2 22.17,26.2 22.08,26.28 | 22.08,26.28
HDMI_D0_N
  Top 0.152: X1.9 11.35,28.86 11.7,28.5 17.2,28.5 20.4,25.3 75.5,25.3 77.2,27 77.2,31.47 76.24,32.43 U$1.184
HDMI_D0_P
  Top 0.152: X1.7 11.36,27.86 11.7,28.2 17.07,28.2 20.27,25 75.63,25 77.5,26.87 77.5,31.6 76.28,32.83 U$1.182
HDMI_D1_N
  Top 0.152: U$1.178 76.57,33.63 78.5,31.7 78.5,26.5 76.1,24.1 19.3,24.1 16.39,27 11.7,27 11.35,27.36 X1.6
HDMI_D1_P
  Top 0.152: U$1.176 76.6,34.03 78.81,31.83 78.81,26.37 76.23,23.8 19.17,23.8 16.27,26.7 11.7,26.7 11.36,26.36 X1.4
HDMI_D2_N
  Top 0.152: X1.3 11.35,25.86 11.7,25.5 15.49,25.5 18.1,22.9 76.8,22.9 79.8,25.9 79.8,32.27 77.24,34.83 | U$1.172 77.24,34.83 | 77.25,34.81 77.24,34.83 | 77.24,34.83
HDMI_D2_P
  Top 0.152: U$1.170 77,35.23 77.27,35.23 80.11,32.39 80.11,25.77 76.93,22.59 17.97,22.59 15.37,25.2 11.7,25.2 11.36,24.86 X1.1
N$1
  Top 0.152: IC5.7 88.42,29.98 88.7,29.7 90,29.7 90.35,29.35 C23.1
N$2
  Route2 0.152: 33,69 33,43
N$3
  Top 0.152: IC5.5 87.12,30.43 87,30.3 86.06,30.3 R1.1
N$4
  Top 0.152: Y1.1 87.9,26 88.1,25.8 90,25.8 90.45,26.25 C24.2 91.17,25.98 94.33,25.98 94.48,26.13 U1.40
N$5
  Top 0.152: U1.41 94.5,25.72 94.46,25.67 90.97,25.67 90.45,25.15 C25.2 89.65,25.2 87.98,25.2 87.97,25.2 87.97,25.17 87.38,24.58 87.38,24.55 87.13,24.3 85.8,24.3 85.7,24.4 85.7,24.62 Y1.3
N$6
  Top 0.152: J4.7 27.12,49.58 J4.1 25.7,51 24.6,51 | J4.12 27.12,61.78 J4.6 24.6,59.26 24.6,51 | C33.1 26.15,47.75 24.6,49.3 24.6,51
N$7  (via drill 0.35)
  Top 0.152: S1.1 S1.2 34.41,17.91 v34.5,18 | U$1.93 37.06,30.36 36.68,30.36 36.63,30.3 v34.5,30.3
  Bottom 0.152: v34.5,30.3 v34.5,18
N$8
  Top 0.152: U1.42 92.31,25.31 91.6,24.6 91.6,23.9 91.27,23.57 87.41,23.57 87.28,23.7 84.77,23.7 R2.2
N$9
  Top 0.152: X1.15 18.24,31.86 22.71,27.39 71.39,27.39 73.23,29.23 U$1.200
N$10
  Top 0.152: X1.16 18.25,32.36 22.92,27.69 68.99,27.69 70.53,29.23 U$1.199
N$11
  Top 0.152: X1.19 17.18,33.86 23.04,28 68.09,28 68.3,28.2 68.3,38.22 68.65,38.57 69.73,38.57 69.87,38.43 U$1.153
N$12
  Top 0.152: U$1.151 69.9,38.83 69.86,38.88 68.53,38.88 68,38.34 68,28.47 67.82,28.3 23.17,28.3 17.17,34.3 7.4,34.3 6.6,33.5 6.6,31.3 7.04,30.86 X1.13
N$13
  Top 0.152: IC1.1 91.98,58.91 92.55,58.35 Y2.P$2
N$14
  Top 0.152: IC1.2 91.98,60.19 92.65,60.85 Y2.P$1
N$15
  pour Bottom (hatched): 0,77 145,77 145,7 0,7
N$16
  Top 0.152: R6.1 99.45,62.6 C32.2 95.75,60.65 97.03,59.37 U2.2
N$17
  pour Top: 0,7 0,77 145,77 145,7
N$18  (via drill 0.35)
  Top 0.152: J7.2 14.19,39 16.2,37 21.43,37 27.53,43.1 v32.4,43.1 | U$1.103 69.83,48.43 v69.76,48.36
  Bottom 0.152: v32.4,43.1 40.93,43.1 41.73,43.9 62.13,43.9 66.59,48.36 v69.76,48.36
N$19  (via drill 0.35)
  Top 0.152: J7.3 16.19,38.41 17.3,37.3 21.3,37.3 27.91,43.91 v32.4,43.91 | U$1.105 71.16,48 71.77,48 72.01,48.23 72.01,49.02 71.87,49.16 v69.36,49.16
  Bottom 0.152: v32.4,43.91 41.31,43.91 41.6,44.2 62.01,44.2 66.97,49.16 v69.36,49.16
N$24
  Top 0.152: BATT.PWR@1 79.14,61.17 D1.1
N$25
  Top 0.152: D1.3 81.64,58.84 C19.1 83.97,58.78 IC1.8
N$67  (via drill 0.35)
  Top 0.152: U1.22 104.7,28 106.1,29.4 v107,29.4 | v108.8,31.2 109,31.4 R3.2
  Bottom 0.152: v107,29.4 v108.8,31.2
N$68  (via drill 0.35)
  Top 0.152: U1.60 99.01,16.01 98.96,15.96 98.96,14.86 98.3,14.2 92,14.2 91.15,13.35 90.86,13.35 90.76,13.24 v90.58,13.42 | v77.99,43.6 77.73,43.86 77.27,43.86 77.01,43.6 v75.8,43.6
  Bottom 0.152: v90.58,13.42 90.26,13.1 81.5,13.1 80.1,14.5 80.1,24.21 79.84,24.47 79.84,24.93 80.1,25.19 80.1,41.49 v77.99,43.6
N$69
  Top 0.152: U$1.102 77.18,48.83 R4.2
NRTC_INT
  Top 0.152: IC1.3 91.86,61.45 93,62.6 C32.1 R5.1
PCIE_CLK_N  (via drill 0.35)
  Top 0.152: U$1.110 85.5,47.23 89.11,43.62 v89.11,43.5 | v89.2,16.5 90.5,15.2 97.8,15.2 98.2,15.6 U1.58
  Bottom 0.152: v89.11,43.5 88.86,43.25 88.86,16.84 v89.2,16.5
PCIE_CLK_P  (via drill 0.35)
  Top 0.152: U$1.112 85.47,46.83 88.3,44 v88.3,43.5 | v88.63,15.93 89.66,14.89 97.93,14.89 98.02,14.98 98.42,15.38 98.6,15.57 U1.59
  Bottom 0.152: v88.3,43.5 88.55,43.25 88.55,16.01 v88.63,15.93
PCIE_RST  (via drill 0.35)
  Top 0.152: U1.61 99.42,15.98 99.27,15.83 99.27,14.67 98.46,13.86 92.16,13.86 v91.09,12.79 | v72.4,47.2 72.37,47.23 U$1.109
  Bottom 0.152: v72.4,47.2 73.01,47.2 76.47,43.74 77.06,43.74 79.8,41.01 79.8,25.31 79.54,25.06 79.54,24.34 79.8,24.09 79.8,14.3 81.31,12.79 v91.09,12.79
PCIERX_N
  Top 0.152: U1.52 92,21.25 91.48,21.77 90.93,21.22 C18.1
PCIERX_P
  Top 0.152: U1.51 92.15,21.66 91.06,22.75 C17.1
PCIERXCAP_N  (via drill 0.35)
  Top 0.152: U$1.118 76.15,45.63 76.29,45.48 84.11,45.48 85.4,44.2 v85.4,43.5 | C18.2 87.17,21.22 v86.9,21.49
  Bottom 0.152: v85.4,43.5 85.65,43.25 85.65,22.74 v86.9,21.49
PCIERXCAP_P  (via drill 0.35)
  Top 0.152: U$1.116 74.86,46.03 74.91,45.98 76.23,45.98 76.42,45.79 84.24,45.79 86.21,43.82 v86.21,43.5 | C17.2 87.35,22.75 v86.9,22.3
  Bottom 0.152: v86.21,43.5 85.96,43.25 85.96,22.9 86.56,22.3 v86.9,22.3
PCIETX_N  (via drill 0.35)
  Top 0.152: U$1.124 74.86,44.43 74.91,44.48 81.92,44.48 82.5,43.9 v82.5,43.5 | v87.4,19.29 87.65,19.54 92.58,19.54 93.13,20.1 96.2,20.1 96.27,20.03 U1.55
  Bottom 0.152: v82.5,43.5 82.75,43.25 82.75,32.23 83.06,31.93 83.06,31.47 82.75,31.16 82.75,20.87 83.83,19.8 83.86,19.8 84.36,19.29 v87.4,19.29
PCIETX_P  (via drill 0.35)
  Top 0.152: U$1.122 74.86,44.83 74.91,44.78 82.05,44.78 83.31,43.52 v83.31,43.5 | v87.4,20.1 87.65,19.85 92.45,19.85 93,20.41 97.43,20.41 U1.54
  Bottom 0.152: v83.31,43.5 83.06,43.25 83.06,32.36 83.36,32.06 83.36,31.34 83.06,31.04 83.06,21 83.96,20.1 v87.4,20.1
RX0_N
  Top 0.152: U1.31 101.04,31.46 100.19,32.3 100.19,33 | 100.19,33 100.19,33.2 | 100.19,33 99.54,33.65 C14.2
RX0_P
  Top 0.152: U1.30 101.45,31.48 100.5,32.43 100.5,33 | 100.5,33 100.5,33.2 | 100.5,33 101.06,33.56 C13.2
RX1_N
  Top 0.152: U1.25 103.48,28.71 106.2,31.43 106.2,33 | 106.2,33 106.2,33.1 | 106.2,33 105.64,33.56 C10.2
RX1_P
  Top 0.152: U1.24 103.89,28.69 106.5,31.3 106.5,33 | 106.5,33 106.5,33.1 | 106.5,33 107.16,33.66 C9.2
RX2_N
  Top 0.152: U1.10 111.12,22.88 112.06,23.82 112.9,23.82 113.49,24.4 C6.2
RX2_P
  Top 0.152: U1.9 111.15,22.47 112.19,23.51 112.9,23.51 113.54,22.88 C5.2
RX3_N
  Top 0.152: U1.4 107.77,20.44 110.54,17.67 113,17.67 | 113,17.67 113.03,17.67 | 113,17.67 113.64,18.3 C2.2
RX3_P
  Top 0.152: U1.3 107.75,20.03 110.41,17.36 113,17.36 | 113,17.36 113.03,17.36 | 113,17.36 113.58,16.78 C1.2
SATA1_GND  (via drill 0.35)
  Top 0.152: U$2.1_1 130.25,34.05 v130.2,34.1
  Route2 0.152: U$2.1_4 131.94,38 v130,38 | U$2.1_7 131.75,42 v130,42 | v130.2,34.1 130.1,34.1 130,34
  Route15 0.152: v130,38 v130,42
  Bottom 0.152: v130.2,34.1 130,34.3 v130,38
SATA1RX_N
  Top 0.152: U$2.1_3 133.19,36.59 133.6,37 133.6,44.3 132.7,45.2 126.23,45.2 113.1,45.2 arc90 112.83,44.93 112.83,44.92 arc-90 112.57,44.65 112.54,44.65 arc-90 112.28,44.92 112.28,44.93 arc90 112.01,45.2 111.99,45.2 arc90 111.72,44.93 111.72,44.92 arc-90 111.45,44.65 111.43,44.65 arc-90 111.16,44.92 111.16,44.93 arc90 110.9,45.2 99.19,45.2 97.4,43.4 97.4,36.39 C15.1
SATA1RX_P
  Top 0.152: U$2.1_2 133.15,35.32 133.91,36.07 133.91,44.43 132.83,45.51 126.11,45.51 126.1,45.5 99.07,45.5 97.09,43.53 97.09,37 97.09,36.5 97.09,36.37 C16.1
SATA1TX_N  (via drill 0.35)
  Top 0.152: U$2.1_5 130.37,39.13 129.4,40.1 v128.8,40.1 128.5,39.8 126.81,39.8 126.8,39.8 126.4,39.8 122.69,43.51 101.67,43.51 100.09,41.93 100.09,36.8 99.54,36.25 C14.1
SATA1TX_P  (via drill 0.35)
  Top 0.152: 128.85,39.25 128.77,39.25 128.52,39.5 126.93,39.5 126.93,39.49 126.27,39.49 122.57,43.2 119.2,43.2 arc90 118.93,42.93 arc-90 118.67,42.67 116.42,42.67 arc-90 116.15,42.93 arc90 115.89,43.2 101.8,43.2 100.4,41.8 100.4,36.8 101.06,36.14 C13.1 | 128.93,39.25 128.85,39.25 | v128.8,39.3 128.85,39.25
  Bottom 0.152: v128.8,39.3 129.3,39.3 130.4,40.4 U$2.1_6
SATA2_GND  (via drill 0.35)
  Top 0.152: U$2.2_7 137.33,41.67 v137.4,41.6 | U$2.2_4 137.36,37.86 v137.4,37.9 | U$2.2_1 133.75,34.05 v133.7,34.1
  Route2 0.152: v137.4,41.6 137.5,41.6 | v137.4,37.9 137.1,37.9 137,38
  Bottom 0.152: v137.4,41.6 v137.4,37.9 137.5,37.8 137.5,34.5 137.05,34.05 U$2.2_1
SATA2RX_N
  Top 0.152: C11.1 104.11,35.97 103.6,36.48 103.6,40.1 104.6,41.1 121.07,41.1 129.27,32.9 137.23,32.9 138.1,33.77 138.1,34.93 137.03,36 136.44,36.59 U$2.2_3
SATA2RX_P
  Top 0.152: C12.1 103.3,36.48 103.3,40.23 104.47,41.41 109.44,41.41 arc90 109.71,41.67 arc-90 109.98,41.94 114.07,41.94 arc-90 114.33,41.67 arc90 114.6,41.41 121.19,41.41 129.4,33.2 137.1,33.2 137.8,33.9 137.8,34.8 136.9,35.7 136.52,35.32 U$2.2_2
SATA2TX_N
  Top 0.152: 106.3,37.73 107.47,38.91 111.8,38.91 arc90 112.07,39.17 arc-90 112.33,39.44 113.71,39.44 arc-90 113.97,39.17 arc90 114.24,38.91 119.09,38.91 128.15,29.85 138.55,29.85 139.5,30.8 139.5,38.7 138.5,39.7 137,39.7 136.43,39.13 U$2.2_5 | 106.3,37.73 | 106.3,37.73 106.3,36.43 C10.1
SATA2TX_P
  Top 0.152: 106.61,37.61 107.6,38.6 118.97,38.6 128.02,29.55 138.68,29.55 139.81,30.67 139.81,38.83 138.63,40.01 137,40.01 136.6,40.4 U$2.2_6 | 106.61,37.6 106.61,37.61 | 106.61,37.61 106.6,37.6 106.6,36.6 107.16,36.04 C9.1
SATA3_GND  (via drill 0.35)
  Top 0.152: U$3.1_7 129.92,22.62 v129.9,22.6 | U$3.1_4 129.99,18.81 v129.9,18.9 | U$3.1_1 v129.9,15
  Route2 0.152: v129.9,22.6 129.9,22.9 130,23 | v129.9,18.9 130,19 | v129.9,15 130,15
  Bottom 0.152: v129.9,22.6 128.5,21.2 128.5,20.3 v129.9,18.9 v129.9,15
SATA3RX_N
  Top 0.152: C7.1 116.51,25.92 117.12,26.53 122.76,26.53 arc-90 123.03,26.27 123.03,25.77 arc90 123.3,25.5 124.07,25.5 arc90 124.33,25.77 124.33,26.27 arc-90 124.6,26.53 131.17,26.53 133.63,24.07 133.63,17.8 133.38,17.54 U$3.1_3
SATA3RX_P
  Top 0.152: C8.1 116.51,27.45 117.12,26.84 131.29,26.84 133.93,24.2 133.93,17.34 132.87,16.27 U$3.1_2
SATA3TX_N  (via drill 0.35)
  Top 0.152: C6.1 116.51,24.4 117.12,23.79 123.47,23.79 126.47,20.79 129.54,20.79 129.84,21.09 v129.9,21.09
  Bottom 0.152: v129.9,21.09 130.91,20.08 U$3.1_5
SATA3TX_P
  Top 0.152: C5.1 116.51,22.88 117.12,23.48 123.34,23.48 126.34,20.49 130.28,20.49 131.14,21.35 U$3.1_6
SATA4_GND  (via drill 0.35)
  Top 0.152: U$3.2_1 135.28,14.9 v133.7,14.9 | U$3.2_4 v137.49,18.81 v137.5,18.8 | U$3.2_7 137.48,22.62 v137.5,22.6
  Route2 0.152: v133.7,14.9 133.7,15 | v137.5,18.8 137.8,18.8 138,19 | v137.5,22.6 137.4,22.6 137,23
  Bottom 0.152: v137.5,22.6 v137.5,18.8 137.5,15.9 136.6,15 U$3.2_1
SATA4RX_N
  Top 0.152: C3.1 116.63,19.83 117.19,20.39 121.5,20.39 121.75,20.15 124.97,16.93 128.07,13.83 136.86,13.83 137.81,14.77 137.81,16.13 136.39,17.54 U$3.2_3
SATA4RX_P
  Top 0.152: C4.1 115.71,21.3 116.6,21.3 117.2,20.7 121.63,20.7 121.97,20.37 arc90 122.34,20.37 122.49,20.51 arc-90 122.86,20.51 125.33,18.05 arc-90 125.33,17.67 125.18,17.52 arc90 125.18,17.15 128.19,14.14 136.74,14.14 137.5,14.9 137.5,16 136.8,16.7 136.37,16.27 U$3.2_2
SATA4TX_N
  Top 0.152: C2.1 116.51,18.3 117.12,17.69 119.54,17.69 126.83,10.4 138.1,10.4 139.4,11.7 139.4,19.4 138.3,20.5 137,20.5 136.58,20.08 U$3.2_5
SATA4TX_P
  Top 0.152: C1.1 116.51,16.78 117.12,17.39 119.41,17.39 126.7,10.1 138.23,10.1 139.71,11.57 139.71,19.53 138.43,20.8 137,20.8 136.45,21.35 U$3.2_6
SCL  (via drill 0.35)
  Top 0.152: IC1.6 85.44,61.45 v86.2,60.7 86.8,60.1 86.8,56.3 84.9,54.4 65.71,54.4 65.7,54.39 63.69,54.39 42.53,33.23 U$1.80 | J1.2 101.54,69.44 v98.3,66.2
  Bottom 0.152: v98.3,66.2 92.8,60.7 v86.2,60.7
SDA  (via drill 0.35)
  Top 0.152: IC1.5 85.97,62.73 87.17,61.53 v87.17,61.3 87.17,56.17 85.03,54.03 65.72,54.03 | 65.7,54.05 65.72,54.03 | U$1.82 42.6,32.83 63.8,54.03 65.72,54.03 | J1.1 99,67.7 v97.3,66
  Bottom 0.152: v97.3,66 92.6,61.3 v87.17,61.3
SPI_CLK  (via drill 0.35)
  Top 0.152: v118.7,32.8 120.27,32.8 IC4.6 | v109.1,27.8 107.96,26.66 107.57,26.66 107.24,26.33 107.24,25.98 106.99,25.72 U1.17
  Bottom 0.152: v109.1,27.8 109.1,29.2 110,30.1 116.6,30.1 118.7,32.2 v118.7,32.8
SPI_CS
  Top 0.152: IC4.1 114.19,35.3 114.7,34.8 114.7,29.5 114,28.8 111.73,28.8 107.43,24.5 U1.14
SPI_DI
  Top 0.152: IC4.2 114.06,34.03 114.3,33.8 114.3,29.6 113.8,29.1 111.6,29.1 107.41,24.91 U1.15
SPI_DO  (via drill 0.35)
  Top 0.152: IC4.5 119.09,31.5 116,28.4 113,28.4 v112.3,27.7 | v112.1,16.2 111.09,16.2 111.03,16.26 110.94,16.26 107.58,19.62 U1.2
  Bottom 0.152: v112.3,27.7 112.3,16.4 v112.1,16.2
TRD0_N
  Top 0.152: J4.10 30.29,57.71 31.91,56.09 40.8,56.09 44.1,52.8 44.1,47.6 43.7,47.2 41.8,47.2 41.77,47.23 U$1.10
TRD0_P
  Top 0.152: J4.11 28.69,59.74 32.03,56.4 40.93,56.4 44.41,52.93 44.41,47.47 43.83,46.9 41.74,46.9 41.68,46.83 U$1.12
TRD1_N
  Top 0.152: J4.5 26.2,58.73 29.13,55.8 31.77,55.8 31.78,55.79 40.54,55.79 43.7,52.63 43.7,48.93 42.81,48.03 U$1.6
TRD1_P
  Top 0.152: J4.4 27.8,56.7 29,55.49 31.64,55.49 31.65,55.49 40.41,55.49 43.4,52.5 43.4,49.5 42.33,48.43 U$1.4
TRD2_N
  Top 0.152: J4.2 26.26,52.63 28.43,54.8 37.8,54.8 39,53.6 39,47.4 38.8,47.2 38.4,47.2 38.37,47.23 U$1.9
TRD2_P
  Top 0.152: J4.3 27.86,54.66 28.3,55.1 37.93,55.1 39.3,53.73 39.3,47.27 38.93,46.9 38.4,46.9 38.34,46.83 U$1.11
TRD3_N
  Top 0.152: J4.9 28.64,52.84 28.7,52.78 29.18,52.78 30.8,54.41 37.53,54.41 38.6,53.33 38.6,48.47 38.16,48.03 U$1.5
TRD3_P
  Top 0.152: J4.8 28.64,52.42 28.7,52.48 29.31,52.48 30.93,54.1 37.4,54.1 38.3,53.2 38.3,48.6 38.13,48.43 | U$1.3 38.13,48.43 | 38,48.34 38.03,48.34 38.13,48.43
TX0_N
  Top 0.152: U1.33 100.23,28.7 97.4,31.53 97.4,33 | 97.4,33 97.4,33.2 | 97.4,33 98.02,33.62 C15.2
TX0_P
  Top 0.152: U1.34 99.82,28.68 97.09,31.41 97.09,33.2 96.49,33.8 C16.2
TX1_N
  Top 0.152: U1.27 102.67,31.37 103.5,32.2 103.5,33 | 103.5,33 103.5,33.2 | 103.5,33 104.11,33.61 C11.2
TX1_P
  Top 0.152: U1.28 102.26,31.39 103.2,32.33 103.2,33 | 103.2,33 103.2,33.2 | 103.2,33 102.59,33.61 C12.2
TX2_N
  Top 0.152: U1.12 107.54,23.69 110.41,26.56 113,26.56 | 113,26.56 113.03,26.56 | 113,26.56 113.64,25.92 C7.2
TX2_P
  Top 0.152: U1.13 107.52,24.09 110.29,26.86 113,26.86 | 113,26.86 113.03,26.86 | 113,26.86 113.58,27.45 C8.2
TX3_N
  Top 0.152: U1.6 111.23,21.25 112.06,20.41 112.9,20.41 113.49,19.83 C3.2
TX3_P
  Top 0.152: U1.7 111.25,21.66 112.19,20.72 112.9,20.72 113.54,21.35 C4.2

## Text on the board
tPlace: SDA | SCL | GND | 3v3 | 5V | BT | BOOT